# Altium schematic sheet radio.SchDoc: Radio
size A4; Author: Pietro Lorefice; DocumentNumber: 3; Revision: A; SheetNumber: 3; SheetTotal: 3
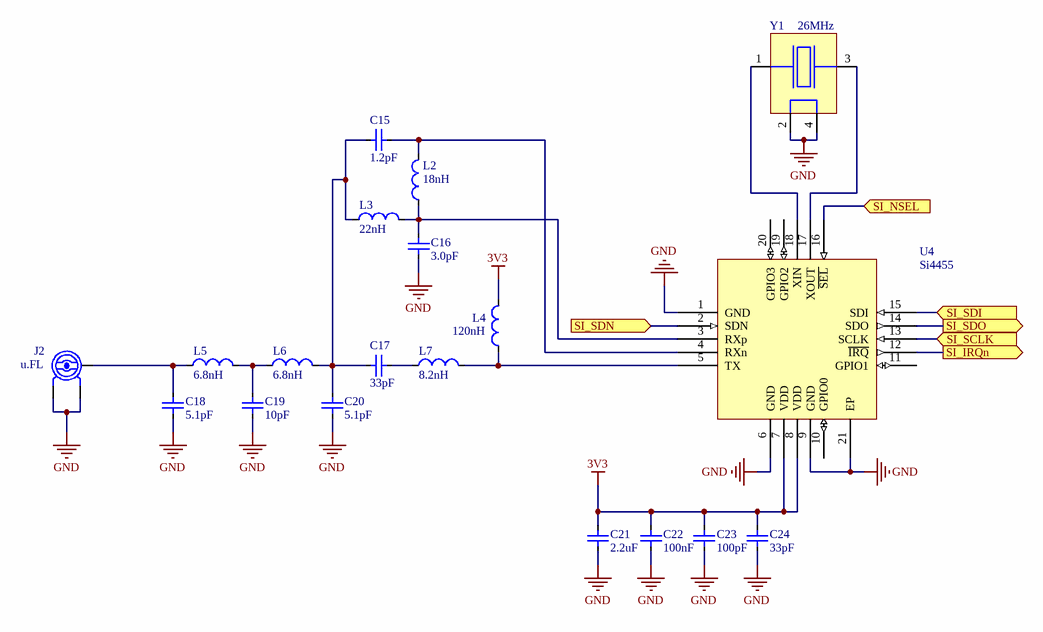
[diagram p0: radio.SchDoc]

## Parts
C15  1.2pF  [0402_[1005]]
C16  3.0pF  [0402_[1005]]
C17  33pF  [0402_[1005]]
C18  5.1pF  [0402_[1005]]
C19  10pF  [0402_[1005]]
C20  5.1pF  [0402_[1005]]
C21  2.2uF  [0603_[1608]]
C22  100nF  [0402_[1005]]
C23  100pF  [0402_[1005]]
C24  33pF  [0402_[1005]]
J2  u.FL  [U.FL_COAXIAL_2.6x2.6MM_STRAIGHT_SMD]
L2  18nH  [0402_[1005]]
L3  22nH  [0402_[1005]]
L4  120nH  [0402_[1005]]
L5  6.8nH  [0402_[1005]]
L6  6.8nH  [0402_[1005]]
L7  8.2nH  [0402_[1005]]
U4  Si4455  [QFN50P300X300X90_HS-21N]
Y1  26MHz  [CRYSTAL_2.5X2MM_4P_SMD]

## Ports
SI_IRQn (out), SI_NSEL (in), SI_SCLK (in), SI_SDI (in), SI_SDN (in), SI_SDO (out)

## Nets
3V3: C21.2 C22.2 C23.2 C24.2 L4.2 U4.7(VDD) U4.8(VDD)
GND: C16.1 C18.1 C19.1 C20.1 C21.1 C22.1 C23.1 C24.1 J2.2(GND) J2.3(GND) U4.1(GND) U4.6(GND) U4.9(GND) U4.21(EP) Y1.2 Y1.4
SI_IRQn: U4.12(~{IRQ}) ; port SI_IRQn
SI_NSEL: U4.16(~{SEL}) ; port SI_NSEL
SI_SCLK: U4.13(SCLK) ; port SI_SCLK
SI_SDI: U4.15(SDI) ; port SI_SDI
SI_SDN: U4.2(SDN) ; port SI_SDN
SI_SDO: U4.14(SDO) ; port SI_SDO
NetC15_1: C15.1 C17.1 C20.2 L3.1 L6.2
NetC15_2: C15.2 L2.2 U4.4(RXn)
NetC16_2: C16.2 L2.1 L3.2 U4.3(RXp)
NetC17_2: C17.2 L7.1
NetC18_2: C18.2 J2.1(SIG) L5.1
NetC19_2: C19.2 L5.2 L6.1
NetL4_1: L4.1 L7.2 U4.5(TX)
NetU4_17: U4.17(XOUT) Y1.3
NetU4_18: U4.18(XIN) Y1.1

Not connected (* = marked no-connect by the designer): U4 10(GPIO0) 11(GPIO1) 19(GPIO2) 20(GPIO3)

## Notes on the sheet
- Title
- Project
- Size:
- Date:
- A4
- Number:
- Time:
- Revision:
- Sheet
- of
- Author:

## Library data of the parts
C15-C24 = C: Capacitor
  C15: Value: 1.2pF
  C16: Value: 3.0pF
  C17 C24: Value: 33pF
  C18 C20: Value: 5.1pF
  C19: Value: 10pF
  C21: Value: 2.2uF
  C22: Value: 100nF
  C23: Value: 100pF
J2 = u.FL: u.FL antenna connector; pin to pad: 1>3 3>1
L2-L7 = L: Inductor
  L2: Value: 18nH
  L3: Value: 22nH
  L4: Value: 120nH
  L5 L6: Value: 6.8nH
  L7: Value: 8.2nH
U4 = Si4455: Low-current OOK/(G)FSK sub-GHz transceiver
Y1 = XTAL-4: Crystal oscillator, 4-pin; Value: 26MHz